# EAGLE schematic BottomBoard_Imu_teensy (EAGLE 9.4.2)
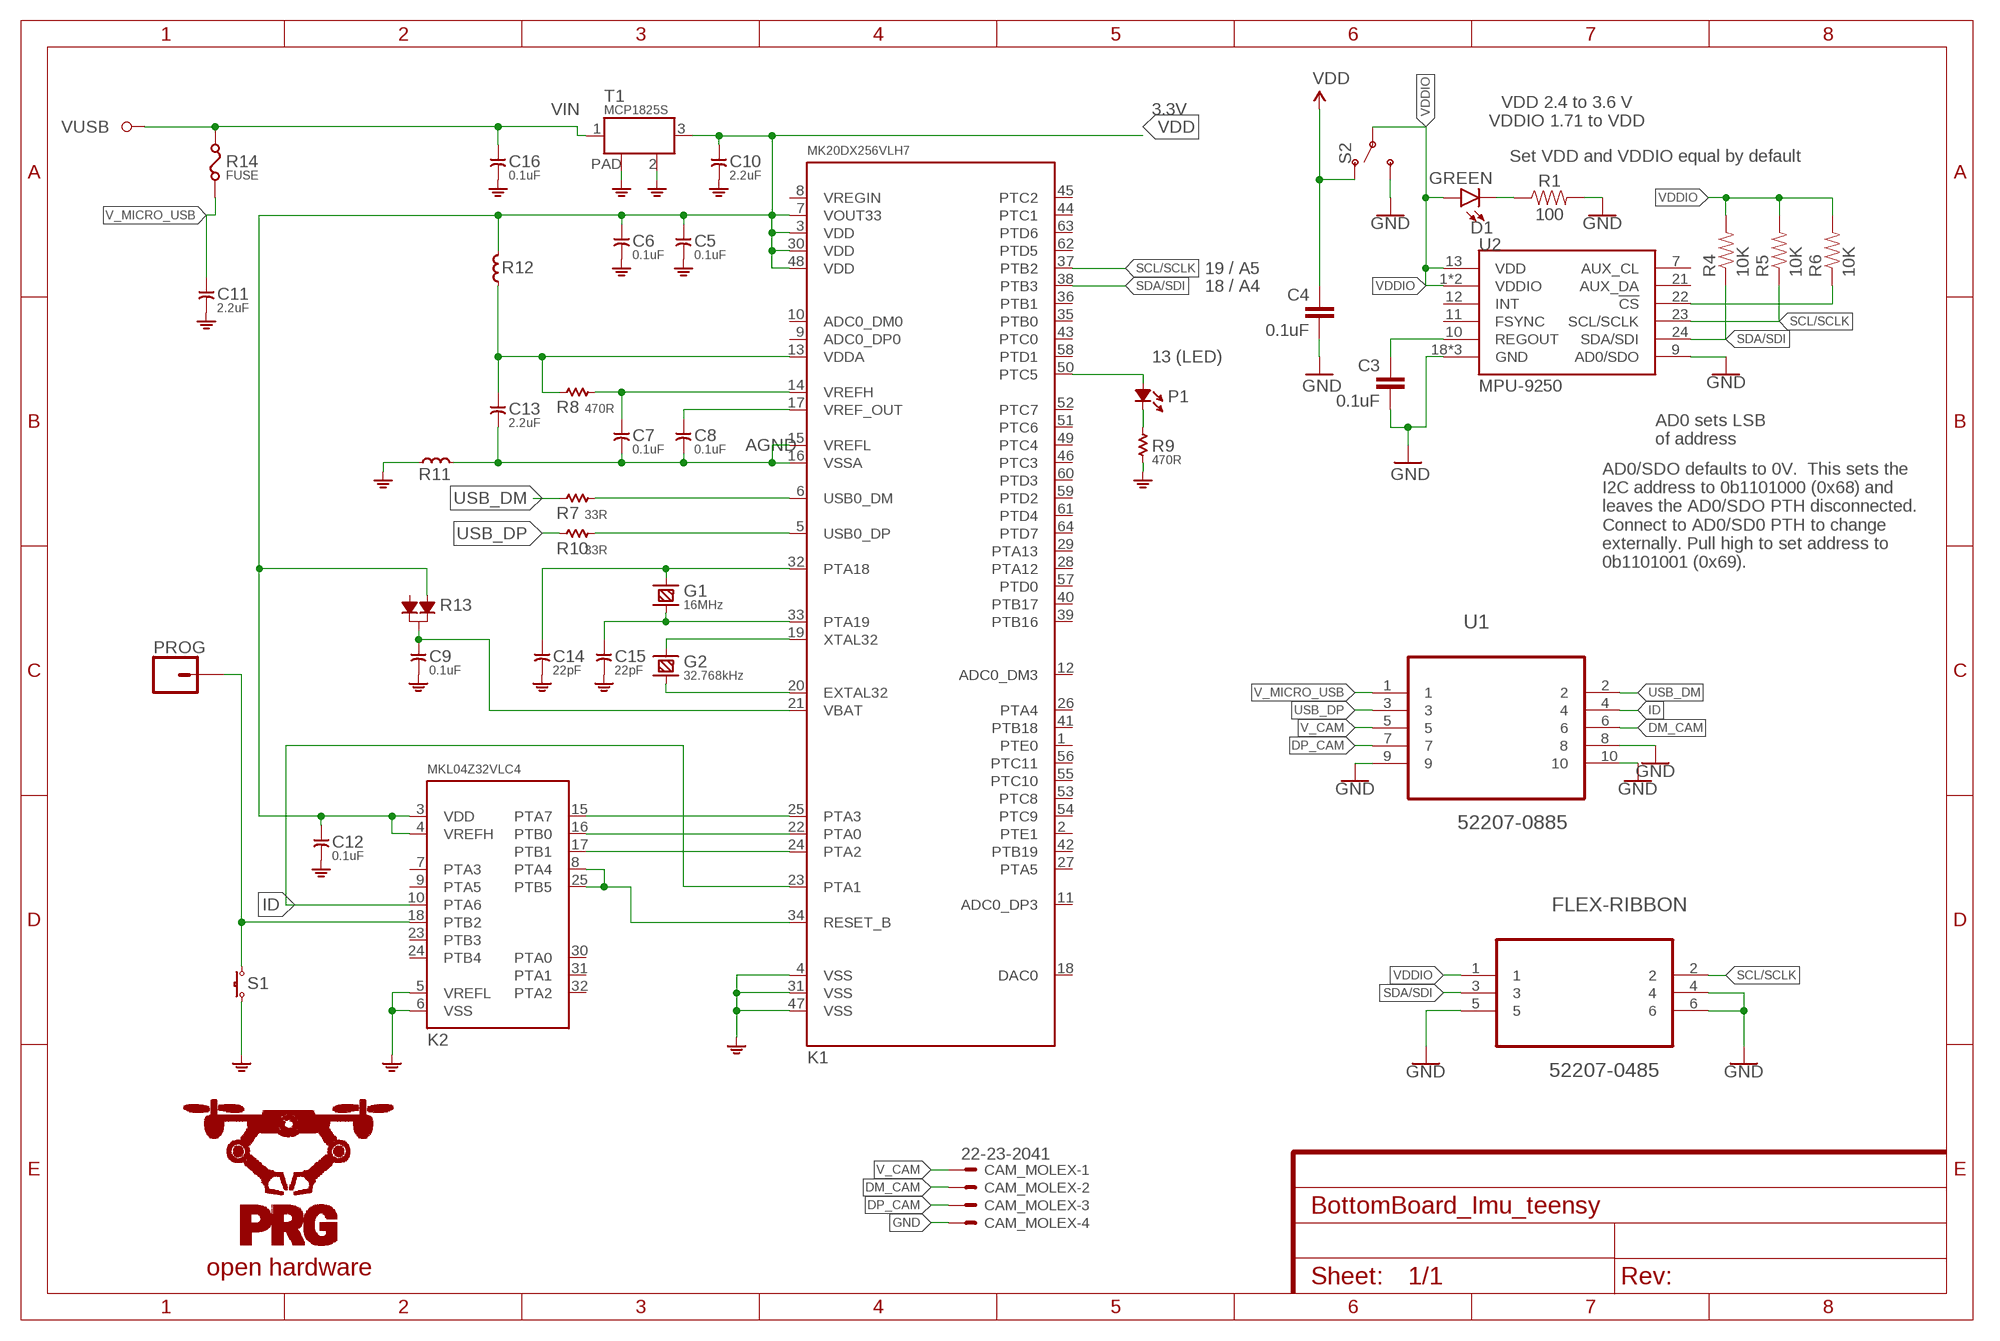
[diagram p0: schematic, sheet 1]

## Parts
C3  0.1uF  0.1UF-25V(+80/-20%)(0603)  [0603-CAP]
C4  0.1uF  0.1UF-25V(+80/-20%)(0603)  [0603-CAP]
C5  0.1uF  CAPACITOR-0.1UF  [C0603]
C6  0.1uF  CAPACITOR-0.1UF  [C0603]
C7  0.1uF  CAPACITOR-0.1UF  [C0603]
C8  0.1uF  CAPACITOR-0.1UF  [C0603]
C9  0.1uF  CAPACITOR-0.1UF  [C0603]
C10  2.2uF  CAPACITOR-2.2UF  [C0805]
C11  2.2uF  CAPACITOR-2.2UF  [C0805]
C12  0.1uF  CAPACITOR-0.1UF  [C0603]
C13  2.2uF  CAPACITOR-2.2UF  [C0805]
C14  22pF  CAPACITOR-22PF  [C0603]
C15  22pF  CAPACITOR-22PF  [C0603]
C16  0.1uF  CAPACITOR-0.1UF  [C0603]
CAM_MOLEX  22-23-2041  [22-23-2041]
D1  GREEN  LED-GREEN0603  [LED-0603]
FLEX-RIBBON  52207-0485  [MOLEX_52207-0485]
G1  16MHz  CRYSTAL-HC49US  [HC49US]
G2  32.768kHz  CRYSTAL-TC26H  [TC26H]
K1  MK20DX256VLH7  [LQFP64-05]
K2  MKL04Z32VLC4  [LQFP32-08]
P1  LED  [LED-0805]
PROG  CONN_01PTH_2MM  [1X01_2MM]
R1  100  100OHM-0603-1/4W-5%  [0603]
R4  10K  10KOHM-1/10W-1%(0603)0603  [0603-RES]
R5  10K  10KOHM-1/10W-1%(0603)0603  [0603-RES]
R6  10K  10KOHM-1/10W-1%(0603)0603  [0603-RES]
R7  33R  RESISTOR-33R  [R0603]
R8  470R  RESISTOR-470R  [R0603]
R9  470R  RESISTOR-470R  [R0603]
R10  33R  RESISTOR-33R  [R0603]
R11  FERRITE  [L0603]
R12  FERRITE  [L0603]
R13  DIODE_DUAL  [SOT-23]
R14  FUSE  [F0805]
S1  TACT_SWITCH  [ALPS_SKHH]
S2  SWITCH-SPDT-SMD-RIGHT-ANGLE  [SWITCH_SPST_SMD_A]
SX1  PIN  [PTH_39MIL]
T1  MCP1825S  LDO  [SOT-223]
U1  52207-0885  [MOLEX_52207-0885]
U2  MPU-9250  [QFN24_PAD]

## Nets
!CS1: R6.1 U2.22(!CS)
DM_CAM: CAM_MOLEX.2 U1.6
DP_CAM: CAM_MOLEX.3 U1.7
GND: C3.2 C4.2 C5.2 C6.2 C9.2 C10.2 C11.2 C12.2 C14.2 C15.2 C16.2 CAM_MOLEX.4 FLEX-RIBBON.4 FLEX-RIBBON.5 FLEX-RIBBON.6 K1.4(VSS) K1.31(VSS) K1.47(VSS) K2.5(VREFL) K2.6(VSS) R1.2 R9.1 R11.1 S1.3 S1.4 S2.3(S) T1.2(GND) T1.PAD U1.8 U1.9 U1.10 U2.9(AD0/SDO) U2.18(GND) U2.20(GND) U2.CENTER(GND)
ID: K1.23(PTA1) K2.10(PTA6) U1.4
N$1: K1.34(RESET_B) K2.8(PTA4) K2.25(PTB5)
N$2: K1.22(PTA0) K2.16(PTB0)
N$3: K1.24(PTA2) K2.17(PTB1)
N$4: D1.C R1.1
N$5: C14.1 G1.1 K1.32(PTA18)
N$6: C15.1 G1.2 K1.33(PTA19)
N$7: G2.2 K1.19(XTAL32)
N$8: G2.1 K1.20(EXTAL32)
N$9: K2.18(PTB2) PROG.1 S1.1 S1.2
N$10: K1.5(USB0_DP) R10.2
N$11: C8.1 K1.17(VREF_OUT)
N$13: C7.1 K1.14(VREFH) R8.2
N$14: K1.6(USB0_DM) R7.2
N$15: C13.1 K1.13(VDDA) R8.1 R12.1
N$20: P1.- R9.2
N$21: K1.50(PTC5) P1.+
N$53: C7.2 C8.2 C13.2 K1.15(VREFL) K1.16(VSSA) R11.2
N$67: C16.1 R14.2 SX1.1 T1.1(IN)
N$68: C9.1 K1.21(VBAT) R13.3
N$70: K1.25(PTA3) K2.15(PTA7)
REGOUT1: C3.1 U2.10(REGOUT)
SCL/SCLK: FLEX-RIBBON.2 K1.37(PTB2) R5.1 U2.23(SCL/SCLK)
SDA/SDI: FLEX-RIBBON.3 K1.38(PTB3) R4.1 U2.24(SDA/SDI)
USB_DM: R7.1 U1.2
USB_DP: R10.1 U1.3
V_CAM: CAM_MOLEX.1 U1.5
V_MICRO_USB: C11.1 R14.1 U1.1
VCC: C4.1 S2.1(O) ; supply symbol labelled VDD
VDD: C5.1 C6.1 C10.1 C12.1 K1.3(VDD) K1.7(VOUT33) K1.30(VDD) K1.48(VDD) K2.3(VDD) K2.4(VREFH) R12.2 R13.1 T1.3(OUT)
VDDIO: D1.A FLEX-RIBBON.1 R4.2 R5.2 R6.2 S2.2(P) U2.1(VDDIO) U2.8(VDDIO) U2.13(VDD)
Unconnected: K1.1(PTE0) K1.2(PTE1) K1.8(VREGIN) K1.9(ADC0_DP0) K1.10(ADC0_DM0) K1.11(ADC0_DP3) K1.12(ADC0_DM3) K1.18(DAC0) K1.26(PTA4) K1.27(PTA5) K1.28(PTA12) K1.29(PTA13) K1.35(PTB0) K1.36(PTB1) K1.39(PTB16) K1.40(PTB17) K1.41(PTB18) K1.42(PTB19) K1.43(PTC0) K1.44(PTC1) K1.45(PTC2) K1.46(PTC3) K1.49(PTC4) K1.51(PTC6) K1.52(PTC7) K1.53(PTC8) K1.54(PTC9) K1.55(PTC10) K1.56(PTC11) K1.57(PTD0) K1.58(PTD1) K1.59(PTD2) K1.60(PTD3) K1.61(PTD4) K1.62(PTD5) K1.63(PTD6) K1.64(PTD7) K2.7(PTA3) K2.9(PTA5) K2.23(PTB3) K2.24(PTB4) K2.30(PTA0) K2.31(PTA1) K2.32(PTA2) R13.2 U2.7(AUX_CL) U2.11(FSYNC) U2.12(INT) U2.21(AUX_DA)

## Notes on the sheet
- VIN | 3.3V
- VUSB
- VDD 2.4 to 3.6 V
  VDDIO 1.71 to VDD
- Set VDD and VDDIO equal by default
- 19 / A5
- 18 / A4
- 13 (LED)
- AGND
- AD0 sets LSB
  of address
- AD0/SDO defaults to 0V.  This sets the
  I2C address to 0b1101000 (0x68) and
  leaves the AD0/SDO PTH disconnected.
  Connect to AD0/SD0 PTH to change
  externally. Pull high to set address to
  0b1101001 (0x69).
- open hardware

## Library data of the parts
C3 C4 = SparkFun-Capacitors:0.1UF-25V(+80/-20%)(0603): CAP-00810 Ceramic Standard decoupling cap; PROD_ID: CAP-00810
C5-C9 C12 C16 = t32_ref:CAPACITOR-0.1UF; DESC: 0.1uF / 16VDC / X7R; MF: Murata Electronics; MPN: GRM188R71C104KA01D; OC_MOUSER: 81-GRM39X104K16; PACKAGE: 0603; TYPE: Capacitor
C10 C11 C13 = t32_ref:CAPACITOR-2.2UF; DESC: 2.2uF / 25 VDC / X7R; MF: Taiyo Yuden; MPN: TMK212B7225KG-TR; OC_MOUSER: 963-TMK212B7225KG-TR; PACKAGE: 0805; TYPE: Capacitor
C14 C15 = t32_ref:CAPACITOR-22PF; DESC: 22pF / 50VDC / C0G (NP0); MF: Vishay / Vitramon; MPN: VJ0603A220JXACW1BC; OC_MOUSER: 77-VJ0603A220JXACBC; PACKAGE: 0603; TYPE: Capacitor
CAM_MOLEX = con-molex:22-23-2041: .100" (2.54mm) Center Header - 4 Pin
D1 = SparkFun-LED:LED-GREEN: Green SMD LED Used in manufacturing of various products at SparkFun Packages: 0603 - SMD 0603 package [Product Link] <http://www.futureelectronics.com/en/technologies/semiconductors/optoelectronics/leds/Pages/9894312-LTST-C190GKT.aspx?CrossPart=HSMG-C190&IM=0> LilyPad 1206 - SMD1206 LilyPad package [Product Link] <http://www.futureelectronics.com/en/Technologies/Product.aspx?ProductID=IN150NGHARVATEKCORPORATION2049943&IM=0> 1206 - SMD1206 package [Product Link] <http://www.futureelectronics.com/en/technologies/semiconductors/optoelectronics/leds/Pages/8315665-LTST-C150KGKT.aspx?IM=0> 1206 Bottom Mount -SMD 1206 Bottom Mount [Product Link] <http://www.digikey.com/product-detail/en/lite-on-inc/LTST-C230KGKT/160-1456-1-ND/386854> SparkFun Products: Pro Mini 328 -5V <https://www.sparkfun.com/products/821> RedBoard <https://www.sparkfun.com/products/12757> MP3 Trigger <https://www.sparkfun.com/products/13720> Makey Makey <https://www.sparkfun.com/products/11076>; PROD_ID: DIO-00821
FLEX-RIBBON = Molex_By_element14_Batch_1:52207-0485: SOCKET FPC, SMT, 1MM, 4 WAY; MPN: 52207-0485; OC_FARNELL: 1463013; OC_NEWARK: 58J9499; PACKAGE: SOCKET FPC, SMT, 1MM, 4 WAY; SUPPLIER: Molex
G1 = t32_ref:CRYSTAL-; DESC: 16MHz / 18pF / 10ppm; MF: ABRACON; MPN: ABL-16.000MHz-B1U; OC_MOUSER: 815-ABL-16-B1U; PACKAGE: HC-49US; TYPE: Crystal
G2 = t32_ref:CRYSTAL-; DESC: 32.768kHz / 12.5pF / 20ppm; MF: Citizen FineDevice; MPN: CFS206-32.768KDZF-UB; OC_MOUSER: 695-CFS206-327KF-U; PACKAGE: TC-26H; TYPE: Crystal
K1 = t32_ref:MK20DX256VLH7; DESC: MK20DX256VLH7; MF: NXP; MPN: MK20DX256VLH7; OC_MOUSER: 841-MK20DX256VLH7; PACKAGE: LQFP-64; TYPE: Microcontroller
K2 = t32_ref:MKL04Z32VLC4; DESC: MKL04Z32VLC4 (preprogrammed); MF: PJRC; MPN: IC_MKL04Z32_TQFP32; PACKAGE: LQFP-32; TYPE: Microcontroller
P1 = t32_ref:LED; DESC: orange; MF: ROHM Semiconductor; MPN: SML-211DTT86; OC_MOUSER: 755-SML-211DTT86; PACKAGE: 0805; TYPE: LED
PROG = SparkFun-Connectors:CONN_01: Single connection point. Often used as Generic Header-pin footprint for 0.1 inch spaced/style header connections On any of the 0.1 inch spaced packages, you can populate with these: Break Away Headers - Straight <https://www.sparkfun.com/products/116> (PRT-00116) Break Away Male Headers - Right Angle <https://www.sparkfun.com/products/553> (PRT-00553) Female Headers <https://www.sparkfun.com/products/115> (PRT-00115) Break Away Headers - Machine Pin <https://www.sparkfun.com/products/117> (PRT-00117) Break Away Female Headers - Swiss Machine Pin <https://www.sparkfun.com/products/743> (PRT-00743) This device is also useful as a general connection point to wire up your design to another part of your project. Our various solder wires solder well into these plated through hole pads. Hook-Up Wire - Assortment (Stranded, 22 AWG) <https://www.sparkfun.com/products/11375> (PRT-11375) Hook-Up Wire - Assortment (Solid Core, 22 AWG) <https://www.sparkfun.com/products/11367> (PRT-11367) View the entire wire category on our website here <https://www.sparkfun.com/categories/141> Special notes: SMTSO-256-ET is a "flush mount" nut for a 4-40 screw. We mostly use this on specialty testbeds; it is a nice way to connect hardware to your PCB at an adjustable hieght. Also note, the SNAP packages are for using a snappable style connector. We sell a baggie of snaps and they are also used on two LilyPad designs: Snap Assortment - 30 pack (male and female) <https://www.sparkfun.com/products/11347> (DEV-11347) LilyPad Arduino SimpleSnap <https://www.sparkfun.com/products/10941> (DEV-10941) LilyPad SimpleSnap Protoboard <https://www.sparkfun.com/products/10940> (DEV-10940)
R1 = SparkFun-Resistors:100OHM: 100Ω resistor A resistor is a passive two-terminal electrical component that implements electrical resistance as a circuit element. Resistors act to reduce current flow, and, at the same time, act to lower voltage levels within circuits. - Wikipedia; PROD_ID: RES-12438
R4-R6 = SparkFun-Resistors:10KOHM-1/10W-1%(0603): RES-00824; PROD_ID: RES-00824
R7 R10 = t32_ref:RESISTOR-33R; DESC: 33R / 1% / 0.25 W; MF: Panasonic; MPN: ERJ-PA3F33R0V; OC_MOUSER: 667-ERJ-PA3F33R0V; PACKAGE: 0603; TYPE: Resistor
R8 R9 = t32_ref:RESISTOR-470R; DESC: 470R / 1 % / 0.1 W; MF: Vishay; MPN: CRCW0603470RFKEA; OC_MOUSER: 71-CRCW0603-470-E3; PACKAGE: 0603; TYPE: Resistor
R11 R12 = t32_ref:FERRITE; DESC: 600R / 100MHz; MF: Murata Electronics; MPN: BLM18AG601SN1D; OC_MOUSER: 81-BLM11A601S; PACKAGE: 0603; TYPE: Ferrite
R13 = t32_ref:DIODE_DUAL; DESC: Dual Schottky, common cat; MF: NXP Semiconductors; MPN: BAT54C,215; OC_MOUSER: 771-BAT54C-T/R; PACKAGE: SOT-23; TYPE: Diode
R14 = t32_ref:FUSE; DESC: 6V / 0.5A; MF: Bel Fuse; MPN: 0ZCK0050FF2E; OC_MOUSER: 530-0ZCK0050FF2E; PACKAGE: 0805; TYPE: PPTC
S1 = t32_ref:TACT_SWITCH; DESC: SPST; MF: ALPS; MPN: SKHHPKA010; OC_MOUSER: 688-SKHHPK; PACKAGE: 6x6x5 MM; TYPE: Tactile switch
S2 = SparkFun-Switches:SWITCH-SPDT: Single Pole, Double Throw (SPDT) Switch Single-pole, double-throw (SPDT) switch. Variant Overview SMD-AYZ0202 Surface Mount DPDT Switch <https://www.sparkfun.com/products/597> (COM-00597) Used on e.g. LilyPad Arduino USB - ATmega32U4 Board <https://www.sparkfun.com/products/12049> PTH-11.6X4.0MM SPDT Mini Power Switch <https://www.sparkfun.com/products/102> (COM-00102) Used on e.g. SparkFun Simon Says - Through-Hole Soldering Kit <https://www.sparkfun.com/products/10547> (KIT-10547) PTH-11.6X4.0MM-KIT KIT version of SPDT Mini Power Switch - Simplifies soldering by removing tStop of switch pins - only one side can be soldered. PTH-11.6X4.0MM-LOCK LOCK version of SPDT Mini Power Switch - Offset pins hold switch in place for easier soldering. SMD-RIGHT-ANGLE Surface Mount Right Angle Switch <https://www.sparkfun.com/products/10860> (COM-10860) Used on e.g. SparkFun ESP8266 Thing <https://www.sparkfun.com/products/13231>; PROD_ID: SWCH-10651; SF_SKU: COM-10860
SX1 = t32_ref:PIN
T1 = t32_ref:LDO; DESC: 3.3V 500mA; MF: Microchip Technology; MPN: MCP1825S-3302E/DB; OC_MOUSER: 579-MCP1825S-3302EDB; PACKAGE: SOT-223-3; TYPE: Voltage regulator
U1 = Molex_By_element14_Batch_1:52207-0885: SOCKET FPC, SMT, 1MM, 8 WAY; MPN: 52207-0885; OC_FARNELL: -; OC_NEWARK: 07P8553; PACKAGE: SOCKET FPC, SMT, 1MM, 8 WAY; SUPPLIER: Molex
U2 = Testing:MPU-9250: NC pin 19. 2-6 & 14-17 not internally connected. May be used for PCB trace routing.; PROD_ID: IC-13192